# Altium project UHF Transceiver.PrjPCB (part 3 of 3)

## Sheet TMS570LS0914_all.SchDoc: TMS570LS0914
size C; SheetNumber: 8; SheetTotal: 11
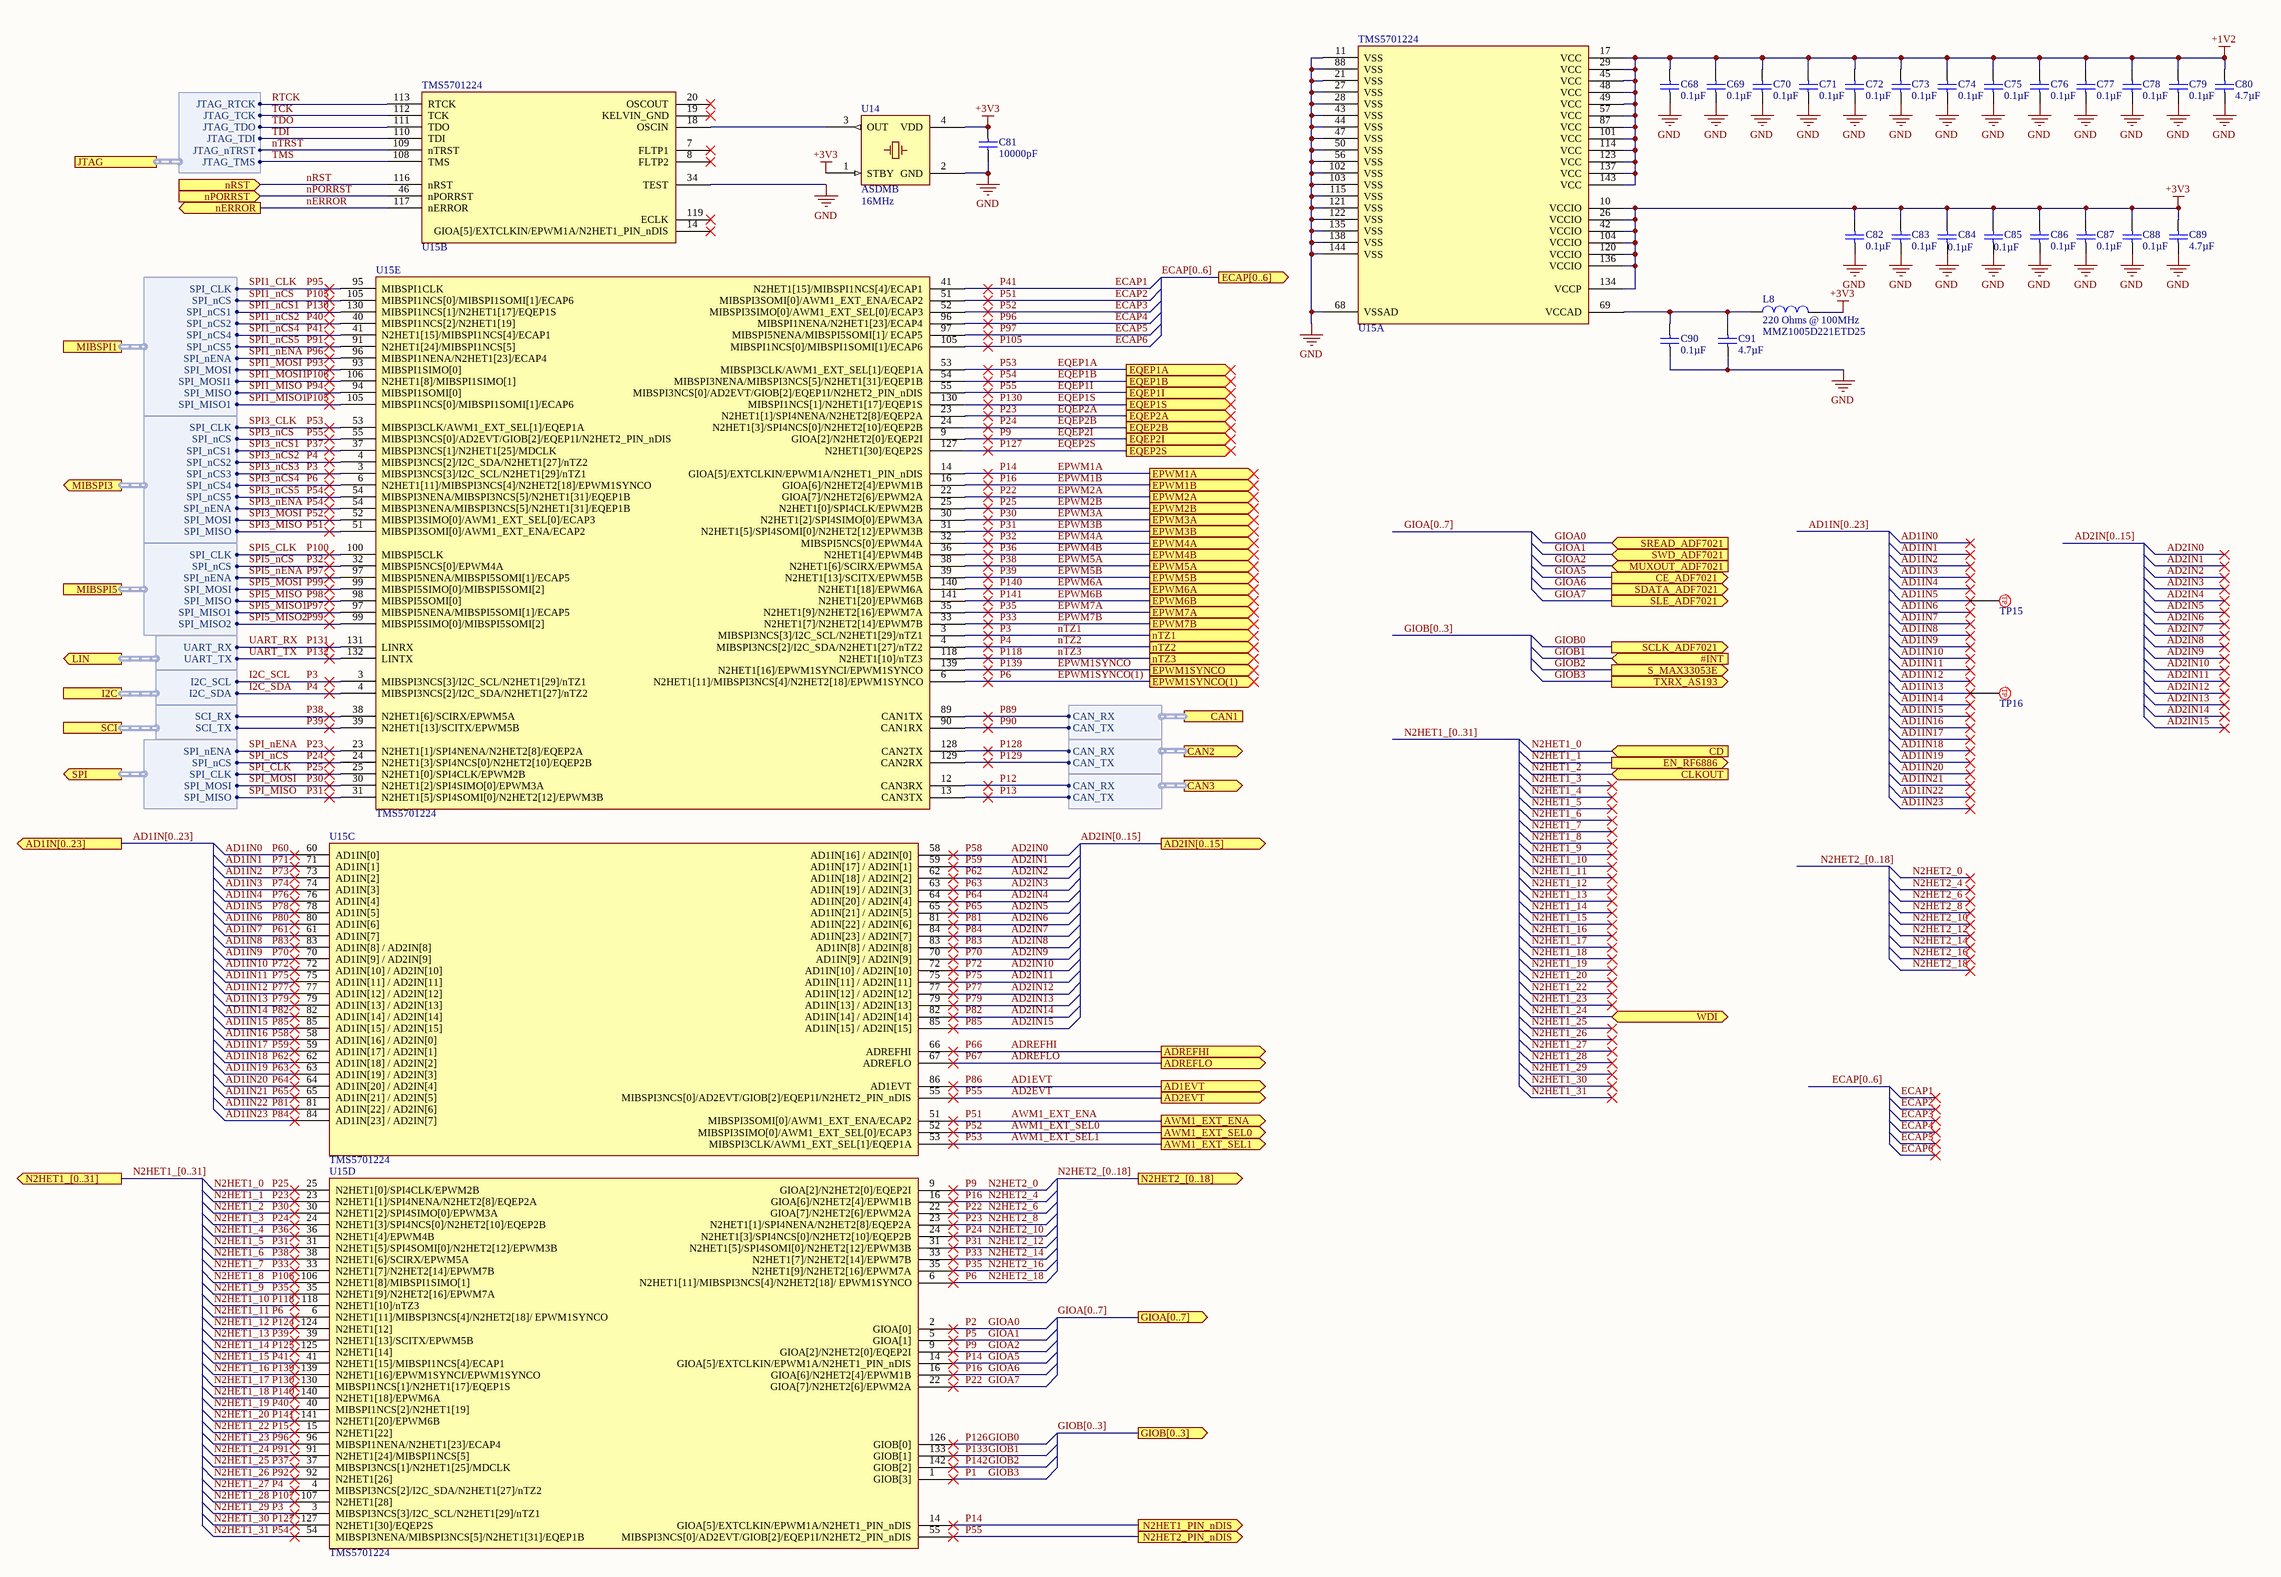
[diagram p9: TMS570LS0914_all.SchDoc]

### Parts
C68  value 0.1µF  [TDK-CGA2B]  (hidden comment: Cap)
C69  value 0.1µF  [TDK-CGA2B]  (hidden comment: Cap)
C70  value 0.1µF  [TDK-CGA2B]  (hidden comment: Cap)
C71  value 0.1µF  [TDK-CGA2B]  (hidden comment: Cap)
C72  value 0.1µF  [TDK-CGA2B]  (hidden comment: Cap)
C73  value 0.1µF  [TDK-CGA2B]  (hidden comment: Cap)
C74  value 0.1µF  [TDK-CGA2B]  (hidden comment: Cap)
C75  value 0.1µF  [TDK-CGA2B]  (hidden comment: Cap)
C76  value 0.1µF  [TDK-CGA2B]  (hidden comment: Cap)
C77  value 0.1µF  [TDK-CGA2B]  (hidden comment: Cap)
C78  value 0.1µF  [TDK-CGA2B]  (hidden comment: Cap)
C79  value 0.1µF  [TDK-CGA2B]  (hidden comment: Cap)
C80  value 4.7µF  [TDK-CGA4J]  (hidden comment: Cap)
C81  value 10000pF  [TDK-CGA2B]  (hidden comment: Cap)
C82  value 0.1µF  [TDK-CGA2B]  (hidden comment: Cap)
C83  value 0.1µF  [TDK-CGA2B]  (hidden comment: Cap)
C84  value 0.1µF  [TDK-CGA2B]  (hidden comment: Cap)
C85  value 0.1µF  [TDK-CGA2B]  (hidden comment: Cap)
C86  value 0.1µF  [TDK-CGA2B]  (hidden comment: Cap)
C87  value 0.1µF  [TDK-CGA2B]  (hidden comment: Cap)
C88  value 0.1µF  [TDK-CGA2B]  (hidden comment: Cap)
C89  value 4.7µF  [TDK-CGA4J]  (hidden comment: Cap)
C90  value 0.1µF  [TDK-CGA2B]  (hidden comment: Cap)
C91  value 4.7µF  [TDK-CGA4J]  (hidden comment: Cap)
L8  value 220 Ohms @ 100MHz  Manufacturer Part Number: MMZ1005D221ETD25  [TDK-MMZ1005]  (hidden comment: Inductor)
TP15  5017  [KS-5017]  (value not drawn)
TP16  5017  [KS-5017]  (value not drawn)
U14  ASDMB  value 16MHz  [ABR-ASDMB]
U15  TMS5701224  [TI-S-PQFP-G144]  (parts A,B,C,D,E of 5)

### Ports
#INT (in), AD1EVT (out), AD1IN[0..23] (out), AD2EVT (out), AD2IN[0..15] (out), ADREFHI (out), ADREFLO (out), AWM1_EXT_ENA (out), AWM1_EXT_SEL0 (out), AWM1_EXT_SEL1 (out), CAN1 (harness TMS570_CAN1), CAN2 (out, harness TMS570_CAN2), CAN3 (out, harness TMS570_CAN3), CD (in), CE_ADF7021 (out), CLKOUT (in), ECAP[0..6] (out), EN_RF6886 (out), EPWM1A (out), EPWM1B (out), EPWM1SYNCO (out), EPWM1SYNCO(1) (out), EPWM2A (out), EPWM2B (out), EPWM3A (out), EPWM3B (out), EPWM4A (out), EPWM4B (out), EPWM5A (out), EPWM5B (out), EPWM6A (out), EPWM6B (out), EPWM7A (out), EPWM7B (out), EQEP1A (out), EQEP1B (out), EQEP1I (out), EQEP1S (out), EQEP2A (out), EQEP2B (out), EQEP2I (out), EQEP2S (out), GIOA[0..7] (out), GIOB[0..3] (out), I2C (harness TMS570_I2C), JTAG (harness TMS570_JTAG), LIN (out, harness TMS570_LIN), MIBSPI1 (harness TMS570_MIBSPI1), MIBSPI3 (out, harness TMS570_MIBSPI3), MIBSPI5 (harness TMS570_MIBSPI5), MUXOUT_ADF7021 (in), N2HET1_[0..31] (out), N2HET1_PIN_nDIS (out), N2HET2_[0..18] (out), N2HET2_PIN_nDIS (out), nERROR (out), nPORRST (in), nRST (in), nTZ1 (out), nTZ2 (out), nTZ3 (out), S_MAX33053E (out), SCI (harness TMS570_SCI), SCLK_ADF7021 (out), SDATA_ADF7021 (out), SLE_ADF7021 (out), SPI (out, harness TMS570_SPI), SREAD_ADF7021 (in), SWD_ADF7021 (in), TXRX_AS193 (out), WDI (bidir)

### Harnesses
TMS570_JTAG: JTAG_TMS, JTAG_TCK, JTAG_TDO, JTAG_TDI, JTAG_nTRST, JTAG_RTCK
TMS570_CAN2: CAN_RX, CAN_TX
TMS570_CAN3: CAN_RX, CAN_TX
TMS570_CAN1: CAN_RX, CAN_TX
TMS570_MIBSPI1: SPI_CLK, SPI_nCS, SPI_nCS1, SPI_nCS2, SPI_nCS4, SPI_nCS5, SPI_nENA, SPI_MOSI, SPI_MOSI1, SPI_MISO, SPI_MISO1
TMS570_MIBSPI3: SPI_CLK, SPI_nCS, SPI_nCS1, SPI_nCS2, SPI_nCS3, SPI_nCS4, SPI_nCS5, SPI_nENA, SPI_MOSI, SPI_MISO
TMS570_MIBSPI5: SPI_CLK, SPI_nCS, SPI_nENA, SPI_MOSI, SPI_MISO, SPI_MISO1, SPI_MISO2
TMS570_LIN: UART_RX, UART_TX
TMS570_I2C: I2C_SCL, I2C_SDA
TMS570_SCI: SCI_RX, SCI_TX
TMS570_SPI: SPI_nENA, SPI_nCS, SPI_CLK, SPI_MOSI, SPI_MISO

### Nets
+1V2: C68.2 C69.2 C70.2 C71.2 C72.2 C73.2 C74.2 C75.2 C76.2 C77.2 C78.2 C79.2 C80.2 U15.17(VCC) U15.29(VCC) U15.45(VCC) U15.48(VCC) U15.49(VCC) U15.57(VCC) U15.87(VCC) U15.101(VCC) U15.114(VCC) U15.123(VCC) U15.137(VCC) U15.143(VCC)  [project net POWER17]
+3V3: C81.2 C82.2 C83.2 C84.2 C85.2 C86.2 C87.2 C88.2 C89.2 L8.1 U14.1(STBY) U14.4(VDD) U15.10(VCCIO) U15.26(VCCIO) U15.42(VCCIO) U15.104(VCCIO) U15.120(VCCIO) U15.134(VCCP) U15.136(VCCIO)  [project net POWER19]
GND: C68.1 C69.1 C70.1 C71.1 C72.1 C73.1 C74.1 C75.1 C76.1 C77.1 C78.1 C79.1 C80.1 C81.1 C82.1 C83.1 C84.1 C85.1 C86.1 C87.1 C88.1 C89.1 C90.1 C91.1 U14.2(GND) U15.11(VSS) U15.21(VSS) U15.27(VSS) U15.28(VSS) U15.34(TEST) U15.43(VSS) U15.44(VSS) U15.47(VSS) U15.50(VSS) U15.56(VSS) U15.68(VSSAD) U15.88(VSS) U15.102(VSS) U15.103(VSS) U15.115(VSS) U15.121(VSS) U15.122(VSS) U15.135(VSS) U15.138(VSS) U15.144(VSS)
AD1EVT: U15.86(AD1EVT) ; port AD1EVT  [also labelled P86]
AD1IN0: U15.60(AD1IN[0])  [also labelled P60]
AD1IN1: U15.71(AD1IN[1])  [also labelled P71]
AD1IN2: U15.73(AD1IN[2])  [also labelled P73]
AD1IN3: U15.74(AD1IN[3])  [also labelled P74]
AD1IN4: U15.76(AD1IN[4])  [also labelled P76]
AD1IN5: TP15.1 U15.78(AD1IN[5])  [also labelled P78]
AD1IN6: U15.80(AD1IN[6])  [also labelled P80]
AD1IN7: U15.61(AD1IN[7])  [also labelled P61]
AD1IN8: U15.83(AD1IN[8]_/_AD2IN[8])  [also labelled AD2IN8, P83]
AD1IN9: U15.70(AD1IN[9]_/_AD2IN[9])  [also labelled AD2IN9, P70]
AD1IN10: U15.72(AD1IN[10]_/_AD2IN[10])  [also labelled AD2IN10, P72]
AD1IN11: U15.75(AD1IN[11]_/_AD2IN[11])  [also labelled AD2IN11, P75]
AD1IN12: U15.77(AD1IN[12]_/_AD2IN[12])  [also labelled AD2IN12, P77]
AD1IN13: TP16.1 U15.79(AD1IN[13]_/_AD2IN[13])  [also labelled AD2IN13, P79]
AD1IN14: U15.82(AD1IN[14]_/_AD2IN[14])  [also labelled AD2IN14, P82]
AD1IN15: U15.85(AD1IN[15]_/_AD2IN[15])  [also labelled AD2IN15, P85]
AD1IN16: U15.58(AD1IN[16]_/_AD2IN[0])  [also labelled AD2IN0, P58]
AD1IN17: U15.59(AD1IN[17]_/_AD2IN[1])  [also labelled AD2IN1, P59]
AD1IN18: U15.62(AD1IN[18]_/_AD2IN[2])  [also labelled AD2IN2, P62]
AD1IN19: U15.63(AD1IN[19]_/_AD2IN[3])  [also labelled AD2IN3, P63]
AD1IN20: U15.64(AD1IN[20]_/_AD2IN[4])  [also labelled AD2IN4, P64]
AD1IN21: U15.65(AD1IN[21]_/_AD2IN[5])  [also labelled AD2IN5, P65]
AD1IN22: U15.81(AD1IN[22]_/_AD2IN[6])  [also labelled AD2IN6, P81]
AD1IN23: U15.84(AD1IN[23]_/_AD2IN[7])  [also labelled AD2IN7, P84]
AD2EVT: U15.55(MIBSPI3NCS[0]/AD2EVT/GIOB[2]/EQEP1I/N2HET2_PIN_nDIS) ; port EQEP1I, port N2HET2_PIN_nDIS, port AD2EVT, port MIBSPI3.SPI_nCS  [also labelled EQEP1I, P55, SPI3_nCS]
ADREFHI: U15.66(ADREFHI) ; port ADREFHI  [also labelled P66]
ADREFLO: U15.67(ADREFLO) ; port ADREFLO  [also labelled P67]
AWM1_EXT_ENA: U15.51(MIBSPI3SOMI[0]/AWM1_EXT_ENA/ECAP2) ; port AWM1_EXT_ENA, port MIBSPI3.SPI_MISO  [also labelled ECAP2, P51, SPI3_MISO]
AWM1_EXT_SEL0: U15.52(MIBSPI3SIMO[0]/AWM1_EXT_SEL[0]/ECAP3) ; port AWM1_EXT_SEL0, port MIBSPI3.SPI_MOSI  [also labelled ECAP3, P52, SPI3_MOSI]
AWM1_EXT_SEL1: U15.53(MIBSPI3CLK/AWM1_EXT_SEL[1]/EQEP1A) ; port EQEP1A, port AWM1_EXT_SEL1, port MIBSPI3.SPI_CLK  [also labelled EQEP1A, P53, SPI3_CLK]
ECAP1: U15.41(N2HET1[15]/MIBSPI1NCS[4]/ECAP1) ; port MIBSPI1.SPI_nCS4  [also labelled N2HET1_15, P41, SPI1_nCS4]
ECAP4: U15.96(MIBSPI1NENA/N2HET1[23]/ECAP4) ; port MIBSPI1.SPI_nENA  [also labelled N2HET1_23, P96, SPI1_nENA]
ECAP5: U15.97(MIBSPI5NENA/MIBSPI5SOMI[1]/_ECAP5) ; port MIBSPI5.SPI_nENA, port MIBSPI5.SPI_MISO1  [also labelled P97, SPI5_MISO1, SPI5_nENA]
ECAP6: U15.105(MIBSPI1NCS[0]/MIBSPI1SOMI[1]/ECAP6) ; port MIBSPI1.SPI_nCS, port MIBSPI1.SPI_MISO1  [also labelled P105, SPI1_MISO1, SPI1_nCS]
EPWM1A: U15.14(GIOA[5]/EXTCLKIN/EPWM1A/N2HET1_PIN_nDIS) ; port CE_ADF7021, port EPWM1A, port N2HET1_PIN_nDIS  [also labelled GIOA5, P14]
EPWM1B: U15.16(GIOA[6]/N2HET2[4]/EPWM1B) ; port SDATA_ADF7021, port EPWM1B  [also labelled GIOA6, N2HET2_4, P16]
EPWM1SYNCO: U15.139(N2HET1[16]/EPWM1SYNCI/EPWM1SYNCO) ; port EPWM1SYNCO  [also labelled N2HET1_16, P139]
EPWM1SYNCO(1): U15.6(N2HET1[11]/MIBSPI3NCS[4]/N2HET2[18]/EPWM1SYNCO) ; port EPWM1SYNCO(1), port MIBSPI3.SPI_nCS4  [also labelled N2HET1_11, N2HET2_18, P6, SPI3_nCS4]
EPWM2A: U15.22(GIOA[7]/N2HET2[6]/EPWM2A) ; port SLE_ADF7021, port EPWM2A  [also labelled GIOA7, N2HET2_6, P22]
EPWM2B: U15.25(N2HET1[0]/SPI4CLK/EPWM2B) ; port CD, port EPWM2B, port SPI.SPI_CLK  [also labelled N2HET1_0, P25, SPI_CLK]  [project net CD]
EPWM3A: U15.30(N2HET1[2]/SPI4SIMO[0]/EPWM3A) ; port CLKOUT, port EPWM3A, port SPI.SPI_MOSI  [also labelled N2HET1_2, P30, SPI_MOSI]
EPWM3B: U15.31(N2HET1[5]/SPI4SOMI[0]/N2HET2[12]/EPWM3B) ; port EPWM3B, port SPI.SPI_MISO  [also labelled N2HET1_5, N2HET2_12, P31, SPI_MISO]
EPWM4A: U15.32(MIBSPI5NCS[0]/EPWM4A) ; port EPWM4A, port MIBSPI5.SPI_nCS  [also labelled P32, SPI5_nCS]
EPWM4B: U15.36(N2HET1[4]/EPWM4B) ; port EPWM4B  [also labelled N2HET1_4, P36]
EPWM5A: U15.38(N2HET1[6]/SCIRX/EPWM5A) ; port EPWM5A, port SCI.SCI_RX  [also labelled N2HET1_6, P38]
EPWM5B: U15.39(N2HET1[13]/SCITX/EPWM5B) ; port EPWM5B, port SCI.SCI_TX  [also labelled N2HET1_13, P39]
EPWM6A: U15.140(N2HET1[18]/EPWM6A) ; port EPWM6A  [also labelled N2HET1_18, P140]
EPWM6B: U15.141(N2HET1[20]/EPWM6B) ; port EPWM6B  [also labelled N2HET1_20, P141]
EPWM7A: U15.35(N2HET1[9]/N2HET2[16]/EPWM7A) ; port EPWM7A  [also labelled N2HET1_9, N2HET2_16, P35]
EPWM7B: U15.33(N2HET1[7]/N2HET2[14]/EPWM7B) ; port EPWM7B  [also labelled N2HET1_7, N2HET2_14, P33]
EQEP1B: U15.54(MIBSPI3NENA/MIBSPI3NCS[5]/N2HET1[31]/EQEP1B) ; port EQEP1B, port MIBSPI3.SPI_nCS5, port MIBSPI3.SPI_nENA  [also labelled N2HET1_31, P54, SPI3_nCS5, SPI3_nENA]
EQEP1S: U15.130(MIBSPI1NCS[1]/N2HET1[17]/EQEP1S) ; port EQEP1S, port MIBSPI1.SPI_nCS1  [also labelled N2HET1_17, P130, SPI1_nCS1]
EQEP2A: U15.23(N2HET1[1]/SPI4NENA/N2HET2[8]/EQEP2A) ; port EN_RF6886, port EQEP2A, port SPI.SPI_nENA  [also labelled N2HET1_1, N2HET2_8, P23, SPI_nENA]
EQEP2B: U15.24(N2HET1[3]/SPI4NCS[0]/N2HET2[10]/EQEP2B) ; port EQEP2B, port SPI.SPI_nCS  [also labelled N2HET1_3, N2HET2_10, P24, SPI_nCS]
EQEP2I: U15.9(GIOA[2]/N2HET2[0]/EQEP2I) ; port MUXOUT_ADF7021, port EQEP2I  [also labelled GIOA2, N2HET2_0, P9]
EQEP2S: U15.127(N2HET1[30]/EQEP2S) ; port EQEP2S  [also labelled N2HET1_30, P127]
GIOA0: U15.2(GIOA[0]) ; port SREAD_ADF7021  [also labelled P2]
GIOA1: U15.5(GIOA[1]) ; port SWD_ADF7021  [also labelled P5]
GIOB0: U15.126(GIOB[0]) ; port SCLK_ADF7021  [also labelled P126]
GIOB1: U15.133(GIOB[1]) ; port #INT  [also labelled P133]
GIOB2: U15.142(GIOB[2]) ; port S_MAX33053E  [also labelled P142]
GIOB3: U15.1(GIOB[3]) ; port TXRX_AS193  [also labelled P1]
I2C_SCL: U15.3(MIBSPI3NCS[3]/I2C_SCL/N2HET1[29]/nTZ1) ; port nTZ1, port MIBSPI3.SPI_nCS3, port I2C.I2C_SCL  [also labelled N2HET1_29, nTZ1, P3, SPI3_nCS3]
I2C_SDA: U15.4(MIBSPI3NCS[2]/I2C_SDA/N2HET1[27]/nTZ2) ; port nTZ2, port MIBSPI3.SPI_nCS2, port I2C.I2C_SDA  [also labelled N2HET1_27, nTZ2, P4, SPI3_nCS2]
N2HET1_8: U15.106(N2HET1[8]/MIBSPI1SIMO[1]) ; port MIBSPI1.SPI_MOSI1  [also labelled P106, SPI1_MOSI1]
N2HET1_10: U15.118(N2HET1[10]/nTZ3) ; port nTZ3  [also labelled nTZ3, P118]
N2HET1_12: U15.124(N2HET1[12])  [also labelled P124]
N2HET1_14: U15.125(N2HET1[14])  [also labelled P125]
N2HET1_19: U15.40(MIBSPI1NCS[2]/N2HET1[19]) ; port MIBSPI1.SPI_nCS2  [also labelled P40, SPI1_nCS2]
N2HET1_22: U15.15(N2HET1[22])  [also labelled P15]
N2HET1_24: U15.91(N2HET1[24]/MIBSPI1NCS[5]) ; port WDI, port MIBSPI1.SPI_nCS5  [also labelled P91, SPI1_nCS5]
N2HET1_25: U15.37(MIBSPI3NCS[1]/N2HET1[25]/MDCLK) ; port MIBSPI3.SPI_nCS1  [also labelled P37, SPI3_nCS1]
N2HET1_26: U15.92(N2HET1[26])  [also labelled P92]
N2HET1_28: U15.107(N2HET1[28])  [also labelled P107]
nERROR: U15.117(nERROR) ; port nERROR
nPORRST: U15.46(nPORRST) ; port nPORRST
nRST: U15.116(nRST) ; port nRST
nTRST: U15.109(nTRST) ; port JTAG.JTAG_nTRST
P12: U15.12(CAN3RX) ; port CAN3.CAN_RX
P13: U15.13(CAN3TX) ; port CAN3.CAN_TX
P89: U15.89(CAN1TX) ; port CAN1.CAN_RX  [project net CAN_RX]
P90: U15.90(CAN1RX) ; port CAN1.CAN_TX  [project net CAN_TX]
P93: U15.93(MIBSPI1SIMO[0]) ; port MIBSPI1.SPI_MOSI  [also labelled SPI1_MOSI]
P94: U15.94(MIBSPI1SOMI[0]) ; port MIBSPI1.SPI_MISO  [also labelled SPI1_MISO]
P95: U15.95(MIBSPI1CLK) ; port MIBSPI1.SPI_CLK  [also labelled SPI1_CLK]
P98: U15.98(MIBSPI5SOMI[0]) ; port MIBSPI5.SPI_MISO  [also labelled SPI5_MISO]
P99: U15.99(MIBSPI5SIMO[0]/MIBSPI5SOMI[2]) ; port MIBSPI5.SPI_MOSI, port MIBSPI5.SPI_MISO2  [also labelled SPI5_MISO2, SPI5_MOSI]
P100: U15.100(MIBSPI5CLK) ; port MIBSPI5.SPI_CLK  [also labelled SPI5_CLK]
P128: U15.128(CAN2TX) ; port CAN2.CAN_RX
P129: U15.129(CAN2RX) ; port CAN2.CAN_TX
P131: U15.131(LINRX) ; port LIN.UART_RX  [also labelled UART_RX]
P132: U15.132(LINTX) ; port LIN.UART_TX  [also labelled UART_TX]
RTCK: U15.113(RTCK) ; port JTAG.JTAG_RTCK
TCK: U15.112(TCK) ; port JTAG.JTAG_TCK
TDI: U15.110(TDI) ; port JTAG.JTAG_TDI
TDO: U15.111(TDO) ; port JTAG.JTAG_TDO
TMS: U15.108(TMS) ; port JTAG.JTAG_TMS
NetC90_2: C90.2 C91.2 L8.2 U15.69(VCCAD)
NetU14_3: U14.3(OUT) U15.18(OSCIN)

Not connected (* = marked no-connect by the designer): U15 7(FLTP1)* 8(FLTP2)* 19(KELVIN_GND)* 20(OSCOUT)* 119(ECLK)*

### Buses and harness runs
bus AD1IN[0..23]
bus AD1IN[0..23] = port AD1IN[0..23]
bus AD2IN[0..15]
bus AD2IN[0..15] = port AD2IN[0..15]
bus ECAP[0..6]
bus ECAP[0..6] = port ECAP[0..6]
bus GIOA[0..7]
bus GIOA[0..7] = port GIOA[0..7]
bus GIOB[0..3]
bus GIOB[0..3] = port GIOB[0..3]
bus N2HET1_[0..31]
bus N2HET1_[0..31] = port N2HET1_[0..31]
bus N2HET2_[0..18]
bus N2HET2_[0..18] = port N2HET2_[0..18]

### Notes on the sheet
- Title
- Size:
- Date:
- File:
- C
- Number:
- Time:
- Revision:
- Sheet
- of
- (in symbol PTP-KS-00001) TP

### Library data of the parts
C68-C79 C82-C88 C90 = PC-TDK-02262: CAP CER 0.1UF 50V X7R 0402; Manufacturer Part Number: CGA2B3X7R1H104M050BB; Index: 2262; Designator: C?; Tolerance: ±20%; Published: 2016-03-16; LatestRevisionDate: 2016-03-16; LatestRevisionNote: ...; PackageReference: 0402 (1005 Metric); Publisher: AlbertaSat; PackageDescription: Radial Cap, Thru-Hole; 2 Leads; 0.3 in Pin Spacing; Part Number: PC-TDK-02262; Supplier Part Number 1: 445-12271-1-ND; Supplier 1: Digi-key; Supplier Link: http://www.digikey.ca/product-search/en?keywords=445-12271-1-ND; Voltage - Rated: 50V; Temperature Coefficient: X7R; Applications: Automotive
C80 C89 C91 = PC-TDK-02831: CAP CER 4.7UF 25V X7R 0805; Manufacturer Part Number: CGA4J1X7R1E475M125AC; Index: 2831; Designator: C?; Tolerance: ±20%; Published: 2016-03-16; LatestRevisionDate: 2016-03-16; LatestRevisionNote: ...; PackageReference: 0805 (2012 Metric); Publisher: AlbertaSat; PackageDescription: Radial Cap, Thru-Hole; 2 Leads; 0.3 in Pin Spacing; Part Number: PC-TDK-02831; Supplier Part Number 1: 445-12761-1-ND; Supplier 1: Digi-key; Supplier Link: http://www.digikey.ca/product-search/en?keywords=445-12761-1-ND; Voltage - Rated: 25V; Temperature Coefficient: X7R; Applications: Automotive
C81 = PC-TDK-01877: CAP CER 10000PF 50V X8R 0402; Manufacturer Part Number: CGA2B3X8R1H103K050BB; Index: 1877; Designator: C?; Tolerance: ±10%; Published: 2016-03-16; LatestRevisionDate: 2016-03-16; LatestRevisionNote: ...; PackageReference: 0402 (1005 Metric); Publisher: AlbertaSat; PackageDescription: Radial Cap, Thru-Hole; 2 Leads; 0.3 in Pin Spacing; Part Number: PC-TDK-01877; Supplier Part Number 1: 445-12303-1-ND; Supplier 1: Digi-key; Supplier Link: http://www.digikey.ca/product-search/en?keywords=445-12303-1-ND; Voltage - Rated: 50V; Temperature Coefficient: X8R; Applications: Automotive
L8 = PL-TDK-02958: 1005; Index: 2958; Designator: L?; Current - Rated: 250mA; Published: 2018-07-17; LatestRevisionDate: 2018-07-17; LatestRevisionNote: ...; PackageReference: 0402 (1005 Metric); Publisher: AlbertaSat; PackageDescription: Chip Inductor, 2-Leads, Body 1.00x0.50mm, IPC Low Density; Code_JEITA: 0402; Code_IEC: 1005; Part Number: PL-TDK-02958; Supplier Part Number 1: 445-172789-1-ND; Supplier 1: Digi-key; Supplier Part Number 2: 810-MMZ1005D221ETD25; Supplier 2: Mouser; Supplier Link: 0402; Applications: Automotive
TP15 TP16 = PTP-KS-00001: PC TEST POINT MINI SMD; Index: 1; Designator: TP?; Supplier 1: Digi-key; Supplier 2: Newark; Supplier 3: Mouser; Part Number: PTP-KS-00001; Manufacturer Part Number: 5017; Supplier Part Number 1: 36-5017CT-ND; Publisher: AlbertaSat; Published: 2016-03-15; LatestRevisionDate: 2016-03-15; LatestRevisionNote: ...; PackageReference: KS-5017; PackageDescription: Testpoint Lug Mini SMD 27X10X152; Supplier Link: #http://www.digikey.ca/product-detail/en/keystone-electronics/5017/36-5017TR-ND/2217304#
U14 = PU-ABR-00014: OSC MEMS 16.000MHZ CMOS SMD; Manufacturer Part Number: ASDMB-16.000MHZ-XY-T; Index: 14; Designator: U?; Tolerance: ±10ppm; Part Number: PU-ABR-00014; Supplier Part Number 1: 535-11457-1-ND; Supplier 1: Digi-key; Supplier Part Number 2: 815-ASDMB-16-XY-T; Supplier 2: Mouser; Publisher: AlbertaSat; Published: 2017-10-24; LatestRevisionDate: 2017-10-24; LatestRevisionNote: ...; PackageReference: 4-SMD, No Lead; PackageDescription: DFN, 4-Leads, Body 2.00x2.50mm, Pitch 1.65mm, IPC Low Density; Supplier Link: http://www.digikey.ca/product-search/en?keywords=535-11457-1-ND
U15 = 59: IC MCU 32BIT 1.25MB FLASH 144QFP; Part Number: 59; Designator: U?; Core Processor: Arm-Cortex - R4F; Core Size: 32-Bit; Speed: 160MHz; Program Memory Size: 1280KB (1280K x 8); RAM Size: 192K (192K X 8); Supplier Part Number 2: 595-MS5701224CPGEQQ1; Supplier 2: Mouser; Manufacturer Part Number: TMS5701224CPGEQQ1; Supplier Part Number 1: 296-47200-ND; Supplier 1: Digi-Key; Supplier Link: #https://www.digikey.ca/product-detail/en/texas-instruments/TMS5701224CPGEQQ1/296-47200-ND/5414218#; PackageReference: 144-LQFP; Operating Temperature: -40°C ~ 125°C (TJ)

## Sheet TCAN337 CANbus Transceiver.SchDoc: MAX33053E CANbus Transciever
size Letter; SheetNumber: 9; SheetTotal: 11
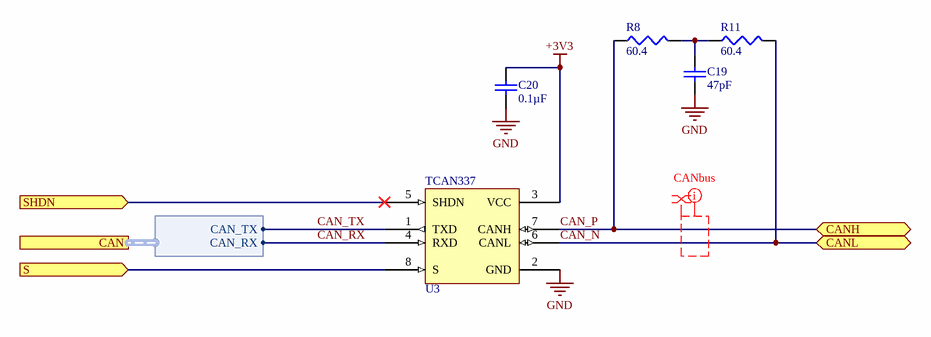
[diagram p10: TCAN337 CANbus Transceiver.SchDoc]

### Parts
C19  value 47pF  [TDK-CGA2B]  (hidden comment: Cap)
C20  value 0.1µF  [TDK-CGA2B]  (hidden comment: Cap)
R8  value 60.4  [PANA-ERA2A]  (hidden comment: Res3)
R11  value 60.4  [PANA-ERA2A]  (hidden comment: Res3)
U3  TCAN337  [TI-R-PDSO-G8]

### Ports
CAN (harness MAX33053E_CAN), CANH (bidir), CANL (bidir), S (in), SHDN (in)

### Harnesses
MAX33053E_CAN: CAN_RX, CAN_TX

### Nets
+3V3: C20.1 U3.3(VCC)  [project net POWER19]
GND: C19.1 C20.2 U3.2(GND)
CAN_N: R11.2 U3.6(CANL) ; port CANL
CAN_P: R8.1 U3.7(CANH) ; port CANH
CAN_RX: U3.4(RXD) ; port CAN.CAN_RX
CAN_TX: U3.1(TXD) ; port CAN.CAN_TX
GIOB2: U3.8(S) ; port S
NetC19_2: C19.2 R8.2 R11.1
NetU3_5: U3.5(SHDN) ; port SHDN

### Layout directives
net class CANbus; rule Impedance Constraint [Min = 120.0    Max = 120.0    ]: (no net found under the mark)
differential pair: (no net found under the mark)

### Notes on the sheet
- (the "License"); you may not use or redistribute this file except in compliance with the License. You
- This file and the information within it are licensed under the terms of the Apache License, Version 2.0
- Copyright
- Unless required by applicable law or agreed to in writing, content distributed under the License is
- distributed on an "AS IS" BASIS, WITHOUT WARRANTIES OR CONDITIONS OF ANY KIND,
- either express or implied. See the License for the specific language governing permissions and
- limitations under the License.
- may obtain a copy of the License at:
- http://www.apache.org/licenses/LICENSE-2.0
- Title
- Size:
- Date:
- Letter
- Number:
- Time:
- Revision:
- Sheet
- of
- University of Alberta
- Deptartment of Electrical
- and Computer Engineering
- Edmonton AB, Canada
- T6G 1H9
- File:

### Library data of the parts
C19 = PC-TDK-01185: CAP CER 47PF 50V NP0 0402; Manufacturer Part Number: CGA2B2NP01H470J050BA; Index: 1185; Designator: C?; Tolerance: ±5%; Published: 2016-03-16; LatestRevisionDate: 2016-03-16; LatestRevisionNote: ...; PackageReference: 0402 (1005 Metric); Publisher: AlbertaSat; PackageDescription: Radial Cap, Thru-Hole; 2 Leads; 0.3 in Pin Spacing; Part Number: PC-TDK-01185; Supplier Part Number 1: 445-12142-1-ND; Supplier 1: Digi-key; Supplier Link: http://www.digikey.ca/product-search/en?keywords=445-12142-1-ND; Voltage - Rated: 50V; Temperature Coefficient: NP0; Applications: Automotive
C20 = PC-TDK-02259: CAP CER 0.1UF 50V X7R 0402; Manufacturer Part Number: CGA2B3X7R1H104K050BB; Index: 2259; Designator: C?; Tolerance: ±10%; Published: 2016-03-16; LatestRevisionDate: 2016-03-16; LatestRevisionNote: ...; PackageReference: 0402 (1005 Metric); Publisher: AlbertaSat; PackageDescription: Radial Cap, Thru-Hole; 2 Leads; 0.3 in Pin Spacing; Part Number: PC-TDK-02259; Supplier Part Number 1: 445-6899-1-ND; Supplier 1: Digi-key; Supplier Link: http://www.digikey.ca/product-search/en?keywords=445-6899-1-ND; Voltage - Rated: 50V; Temperature Coefficient: X7R; Applications: Automotive
R8 R11 = 13829: RES SMD 60.4 OHM 0.1% 1/16W 0402; Part Number: 13829; Manufacturer Part Number: ERA-2AEB60R4X; Designator: R?; Power: 0.063W, 1/16W; Temperature Coefficient: ±25ppm/°C; Published: 8-Jun-2000; LatestRevisionDate: 29-May-2009; LatestRevisionNote: IPC-7351 Footprint Added.; PackageReference: 0402 (1005 Metric); Publisher: Altium Limited; PackageDescription: Chip Resistor, 2-Leads, Body 1.00x0.50mm, IPC Low Density; Supplier Part Number 1: P60.4DCCT-ND; Supplier 1: Digi-Key; Supplier Link: http://www.digikey.ca/product-search/en?keywords=P60.4DCCT-ND; Tolerance: ±0.1%
U3 = 78: IC TXRX CAN 3.3V SOT23-8; Part Number: 78; Manufacturer Part Number: TCAN337GDCNR; Designator: U?; Supplier Part Number 2: 595-TCAN337GDCNR; Supplier 2: Mouser; Supplier Part Number 1: 296-48971-1-ND; Supplier 1: Digi-Key; Supplier Link: #https://www.digikey.ca/product-detail/en/texas-instruments/TCAN337GDCNR/296-48971-1-ND/8635034#; PackageReference: SOT-23-8; Operating Temperature: -40°C ~ 125°C

## Nets that join several sheets
GND: UHF Transceiver Schematic (21 pins), TMP421 Temperature Sensor1 (C48_TMP421_Temperature_Sensor1.2 J1_TMP421_Temperature_Sensor1.1 J2_TMP421_Temperature_Sensor1.1 U7_TMP421_Temperature_Sensor1.5), TMP421 Temperature Sensor2 (C48_TMP421_Temperature_Sensor2.2 J1_TMP421_Temperature_Sensor2.1 J2_TMP421_Temperature_Sensor2.1 U7_TMP421_Temperature_Sensor2.5), RF6886 Amplifier (34 pins), ADF7021 Transceiver (31 pins), RTCMK RTC (C45.2 C46.2 U6.3 U6.4), Stack Header (27 pins), MicroSD SPI Interface (7 pins), Miscellaneous (12 pins), TMS570LS0914_all (45 pins), TCAN337 CANbus Transceiver (C19.1 C20.2 U3.2)
POWER17: Stack Header (H1.50), TMS570LS0914_all (25 pins)
POWER19: UHF Transceiver Schematic (R21.1 R22.1 R23.1), TMP421 Temperature Sensor1 (C48_TMP421_Temperature_Sensor1.1 J1_TMP421_Temperature_Sensor1.3 J2_TMP421_Temperature_Sensor1.3 U7_TMP421_Temperature_Sensor1.8), TMP421 Temperature Sensor2 (C48_TMP421_Temperature_Sensor2.1 J1_TMP421_Temperature_Sensor2.3 J2_TMP421_Temperature_Sensor2.3 U7_TMP421_Temperature_Sensor2.8), RTCMK RTC (R18.2 U6.1), Stack Header (H1.52), MicroSD SPI Interface (C62.1 C63.1 R12.2 U12.4), Miscellaneous (13 pins), TMS570LS0914_all (19 pins), TCAN337 CANbus Transceiver (C20.1 U3.3)
VRF(3V3): UHF Transceiver Schematic (5 pins), RF6886 Amplifier (6 pins), ADF7021 Transceiver (15 pins)
AD2EVT: MicroSD SPI Interface (U12.1), TMS570LS0914_all (U15.55)
AWM1_EXT_ENA: MicroSD SPI Interface (U12.7), TMS570LS0914_all (U15.51)
AWM1_EXT_SEL0: MicroSD SPI Interface (U12.2), TMS570LS0914_all (U15.52)
AWM1_EXT_SEL1: MicroSD SPI Interface (U12.5), TMS570LS0914_all (U15.53)
CAN_N: Stack Header (H1.1), TCAN337 CANbus Transceiver (R11.2 U3.6)
CAN_P: Stack Header (H1.3), TCAN337 CANbus Transceiver (R8.1 U3.7)
CAN_RX: TMS570LS0914_all (U15.89), TCAN337 CANbus Transceiver (U3.4)
CAN_TX: TMS570LS0914_all (U15.90), TCAN337 CANbus Transceiver (U3.1)
CD: UHF Transceiver Schematic (D2.2), MicroSD SPI Interface (R12.1 U12.10 U12.11), TMS570LS0914_all (U15.25)
ECAP6: ADF7021 Transceiver (R4.1), TMS570LS0914_all (U15.105)
EPWM1A: ADF7021 Transceiver (U2.24), TMS570LS0914_all (U15.14)
EPWM1B: ADF7021 Transceiver (P1.5 U2.26), TMS570LS0914_all (U15.16)
EPWM2A: ADF7021 Transceiver (P1.3 U2.25), TMS570LS0914_all (U15.22)
EPWM3A: RTCMK RTC (U6.5), TMS570LS0914_all (U15.30)
EPWM4A: Stack Header (H1.15), TMS570LS0914_all (U15.32)
EPWM5A: Stack Header (H1.22), TMS570LS0914_all (U15.38)
EPWM5B: Stack Header (H1.23), TMS570LS0914_all (U15.39)
EQEP2A: RF6886 Amplifier (U4.3), TMS570LS0914_all (U15.23)
EQEP2I: ADF7021 Transceiver (U2.37), TMS570LS0914_all (U15.9)
GIOA0: ADF7021 Transceiver (P1.7 U2.27), TMS570LS0914_all (U15.2)
GIOA1: ADF7021 Transceiver (P1.11 U2.33), TMS570LS0914_all (U15.5)
GIOB0: ADF7021 Transceiver (P1.9 U2.28), TMS570LS0914_all (U15.126)
GIOB1: RTCMK RTC (U6.2), TMS570LS0914_all (U15.133)
GIOB2: TMS570LS0914_all (U15.142), TCAN337 CANbus Transceiver (U3.8)
GIOB3: UHF Transceiver Schematic (U9.2 U11.4), TMS570LS0914_all (U15.1)
I2C_SCL: UHF Transceiver Schematic (R21.2), TMP421 Temperature Sensor1 (U7_TMP421_Temperature_Sensor1.7), TMP421 Temperature Sensor2 (U7_TMP421_Temperature_Sensor2.7), RTCMK RTC (U6.6), TMS570LS0914_all (U15.3)
I2C_SDA: UHF Transceiver Schematic (R22.2), TMP421 Temperature Sensor1 (U7_TMP421_Temperature_Sensor1.6), TMP421 Temperature Sensor2 (U7_TMP421_Temperature_Sensor2.6), RTCMK RTC (U6.7), TMS570LS0914_all (U15.4)
N2HET1_24: Miscellaneous (U13.4), TMS570LS0914_all (U15.91)
nERROR: Miscellaneous (D3.2), TMS570LS0914_all (U15.117)
NetC41_2: UHF Transceiver Schematic (C57.2 TP12.1), RF6886 Amplifier (C41.2 C42.2 C43.2 R17.2)
NetC44_1: UHF Transceiver Schematic (C56.1), RF6886 Amplifier (C44.1 L4.2)
NetC52_2: UHF Transceiver Schematic (C52.2), ADF7021 Transceiver (L2.2 U2.6)
NetC56_2: UHF Transceiver Schematic (C56.2 TP11.1), ADF7021 Transceiver (L1.1 U2.4)
nPORRST: Miscellaneous (5 pins), TMS570LS0914_all (U15.46)
nRST: Miscellaneous (C65.2 R25.1 R27.2), TMS570LS0914_all (U15.116)
nTRST: Miscellaneous (P4.2), TMS570LS0914_all (U15.109)
P93: ADF7021 Transceiver (R7.1), TMS570LS0914_all (U15.93)
P94: ADF7021 Transceiver (R6.2), TMS570LS0914_all (U15.94)
P95: ADF7021 Transceiver (R5.1), TMS570LS0914_all (U15.95)
P99: Stack Header (H1.19), TMS570LS0914_all (U15.99)
P100: Stack Header (H1.20), TMS570LS0914_all (U15.100)
RTCK: Miscellaneous (P4.9 R31.1), TMS570LS0914_all (U15.113)
TCK: Miscellaneous (P4.11 R30.1), TMS570LS0914_all (U15.112)
TDI: Miscellaneous (P4.3 R32.1), TMS570LS0914_all (U15.110)
TDO: Miscellaneous (P4.7), TMS570LS0914_all (U15.111)
TMS: Miscellaneous (P4.1 R33.1), TMS570LS0914_all (U15.108)